# EAGLE design Board1 (EAGLE 9.3.2)
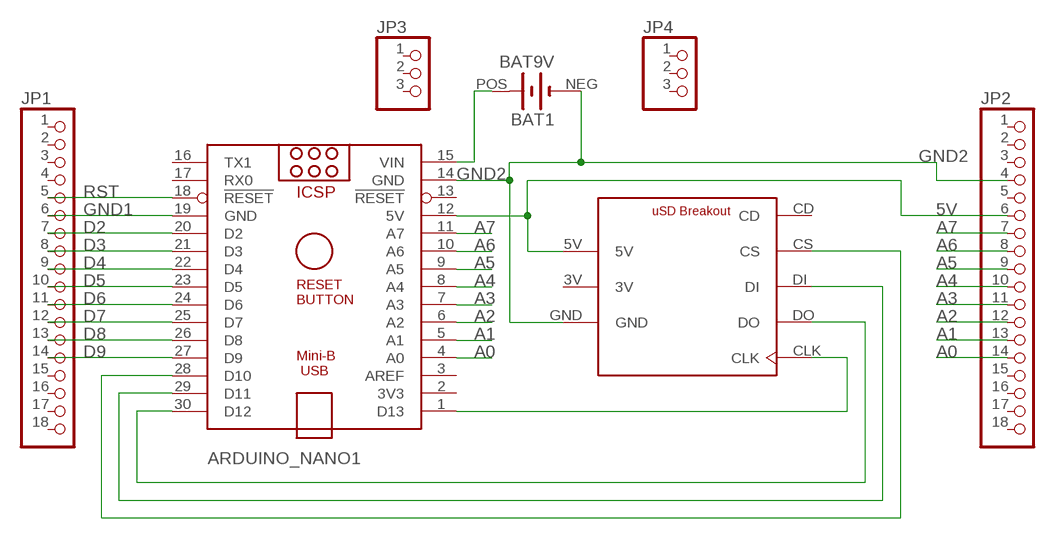
[diagram p0: schematic, sheet 1]

## Parts
ARDUINO_NANO1  ARDUINO_NANO  [ARDUINO_NANO]
BAT1  BAT9V  [BAT9V]
JP1  PINHD-1X18  [1X18]
JP2  PINHD-1X18  [1X18]
JP3  PINHD-1X3  [1X03]
JP4  PINHD-1X3  [1X03]
USD1  ADA254  [ADA254]

## Nets
5V [power]: ARDUINO_NANO1.12(5V) JP2.6 USD1.5V
A0: ARDUINO_NANO1.4(A0) JP2.14
A1: ARDUINO_NANO1.5(A1) JP2.13
A2: ARDUINO_NANO1.6(A2) JP2.12
A3: ARDUINO_NANO1.7(A3) JP2.11
A4: ARDUINO_NANO1.8(A4) JP2.10
A5: ARDUINO_NANO1.9(A5) JP2.9
A6: ARDUINO_NANO1.10(A6) JP2.8
A7: ARDUINO_NANO1.11(A7) JP2.7
D2: ARDUINO_NANO1.20(D2) JP1.7
D3: ARDUINO_NANO1.21(D3) JP1.8
D4: ARDUINO_NANO1.22(D4) JP1.9
D5: ARDUINO_NANO1.23(D5) JP1.10
D6: ARDUINO_NANO1.24(D6) JP1.11
D7: ARDUINO_NANO1.25(D7) JP1.12
D8: ARDUINO_NANO1.26(D8) JP1.13
D9: ARDUINO_NANO1.27(D9) JP1.14
GND1: ARDUINO_NANO1.19(GND) JP1.6
GND2 [power]: ARDUINO_NANO1.14(GND) BAT1.NEG(-) JP2.4 USD1.GND
N$3: ARDUINO_NANO1.1(D13) USD1.CLK
N$4: ARDUINO_NANO1.30(D12) USD1.DO
N$5: ARDUINO_NANO1.29(D11) USD1.DI
N$6: ARDUINO_NANO1.28(D10) USD1.CS
N$16 [power]: ARDUINO_NANO1.15(VIN) BAT1.POS(+)
RST: ARDUINO_NANO1.18(!RESET) JP1.5
Unconnected: ARDUINO_NANO1.2(3V3) ARDUINO_NANO1.3(AREF) ARDUINO_NANO1.13(!RESET) ARDUINO_NANO1.16(TX1) ARDUINO_NANO1.17(RX0) JP1.1 JP1.2 JP1.3 JP1.4 JP1.15 JP1.16 JP1.17 JP1.18 JP2.1 JP2.2 JP2.3 JP2.5 JP2.15 JP2.16 JP2.17 JP2.18 JP3.1 JP3.2 JP3.3 JP4.1 JP4.2 JP4.3 USD1.3V USD1.CD

## Library data of the parts
ARDUINO_NANO1 = ArduinoNanoV30:ARDUINO_NANO: Arduino Nano V3.0 Overview: The Arduino Nano is a small, complete, and breadboard-friendly board based on the ATmega328 (Arduino Nano 3.x) or ATmega168 (Arduino Nano 2.x). It has more or less the same functionality of the Arduino Duemilanove, but in a different package. It lacks only a DC power jack, and works with a Mini-B USB cable instead of a standard one. The Nano was designed and is being produced by Gravitech. Specifications: Microcontroller Atmel ATmega168 or ATmega328 Operating Voltage (logic level) 5 V Input Voltage (recommended) 7-12 V Input Voltage (limits) 6-20 V Digital I/O Pins 14 (of which 6 provide PWM output) Analog Input Pins 8 DC Current per I/O Pin 40 mA Flash Memory 16 KB (ATmega168) or 32 KB (ATmega328) of which 2 KB used by bootloader SRAM 1 KB (ATmega168) or 2 KB (ATmega328) EEPROM 512 bytes (ATmega168) or 1 KB (ATmega328) Clock Speed 16 MHz Dimensions 0.73" x 1.70" Length 45 mm Width 18 mm Weigth 5 g Power: The Arduino Nano can be powered via the Mini-B USB connection, 6-20V unregulated external power supply (pin 30), or 5V regulated external power supply (pin 27). The power source is automatically selected to the highest voltage source. Memory: The ATmega168 has 16 KB of flash memory for storing code (of which 2 KB is used for the bootloader); the ATmega328 has 32 KB, (also with 2 KB used for the bootloader). The ATmega168 has 1 KB of SRAM and 512 bytes of EEPROM (which can be read and written with the EEPROM library); the ATmega328 has 2 KB of SRAM and 1 KB of EEPROM. Input and Output: Each of the 14 digital pins on the Nano can be used as an input or output, using pinMode(), digitalWrite(), and digitalRead() functions. They operate at 5 volts. Each pin can provide or receive a maximum of 40 mA and has an internal pull-up resistor (disconnected by default) of 20-50 kOhms. In addition, some pins have specialized functions. Visit Arduino - ArduinoBoardNano <https://www.arduino.cc/en/Main/ArduinoBoardNano>
BAT1 = cwParts:BAT9V
JP1 JP2 = pinhead:PINHD-1X18: PIN HEADER
JP3 JP4 = pinhead:PINHD-1X3: PIN HEADER
USD1 = cwParts:ADA254: Adafruit microSD breakout

## Net classes
1 power: width 0.508 mm

## Board
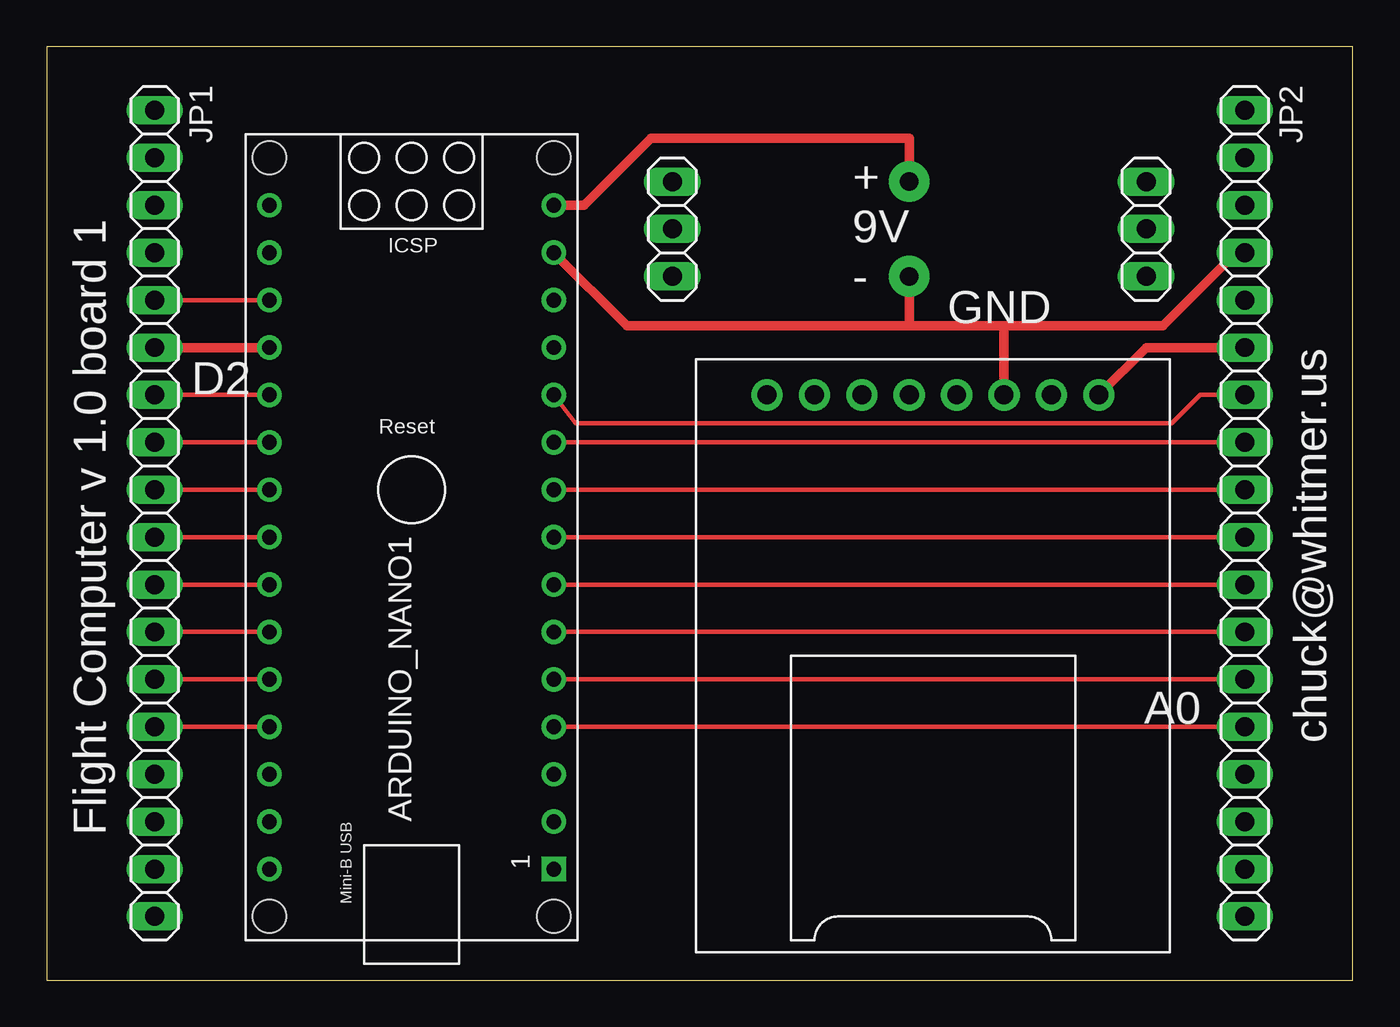
[diagram p1: board, top side]
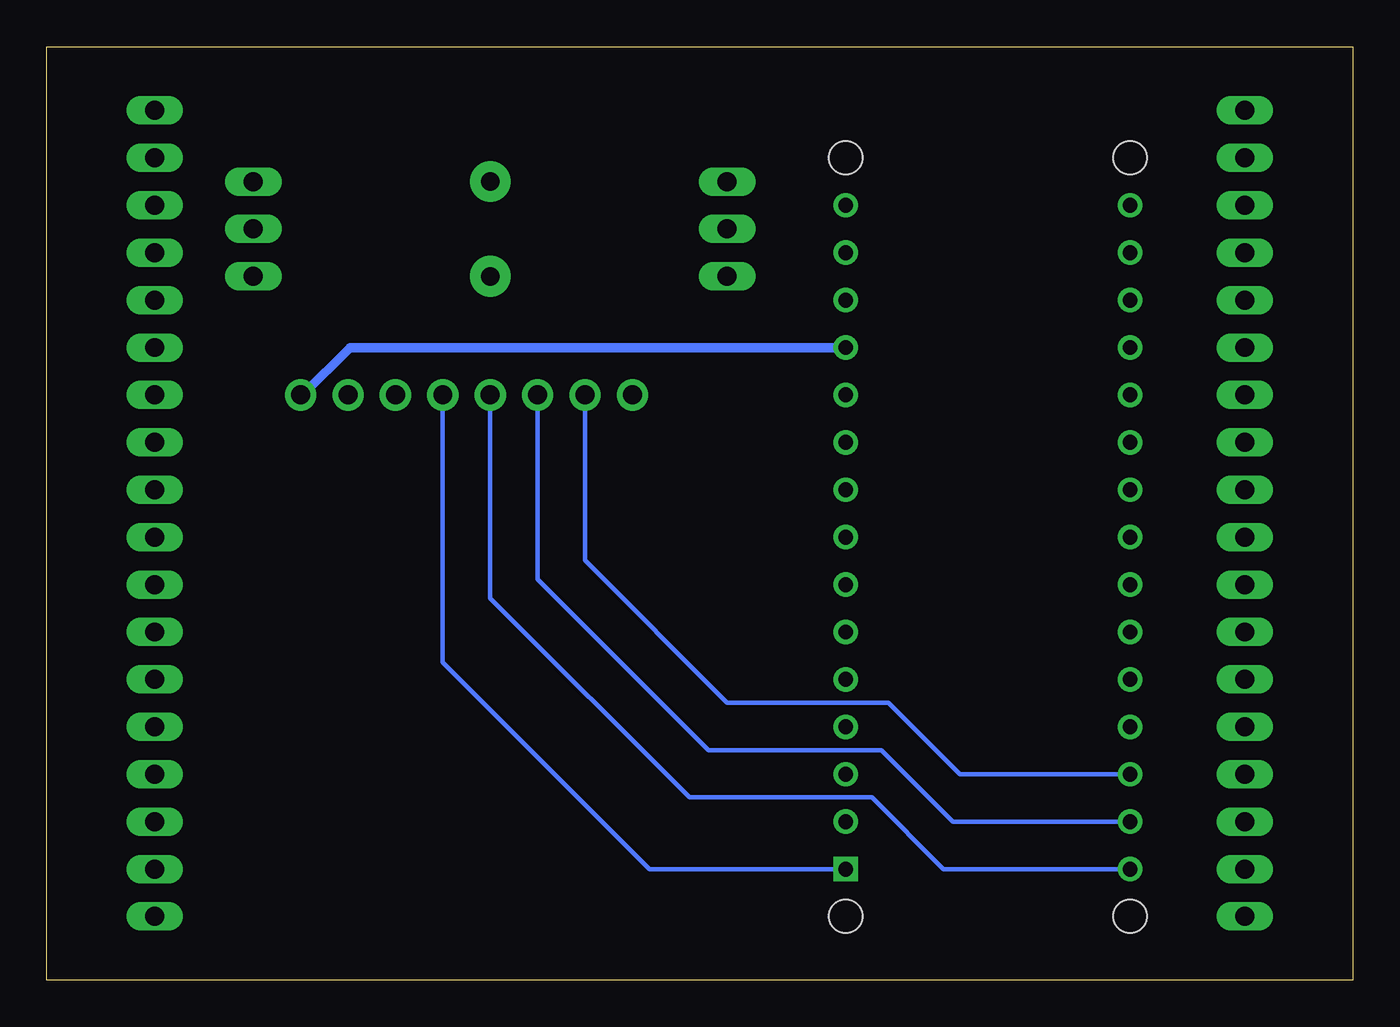
[diagram p2: board, bottom side, seen from below]

Size 70 x 50 mm. Coordinates in mm from the lower left corner, seen from the top.
Outline: 0,0 70,0 70,50 0,50 0,0
Copper layers (1*16): Top 0.035mm / dielectric 1.5mm / Bottom 0.035mm
Design rules "default": minimum track width 6mil, minimum drill 0.35mm, track to track 6mil, track to pad 6mil, pad to pad 6mil, via to via 6mil, smd to smd 6mil, copper to edge 40mil, drill to drill 6mil, minimum pad ring 10mil, minimum via ring 8mil, stop-mask expansion 4mil, vias tented up to drill 0mil, thermal gap 10mil

### Footprints (pad centres in the part's own frame; a part is rotated, then mirrored left to right if it is on the bottom)
ARDUINO_NANO = drill 0.8 square: 1 -20.32,-7.62 | drill 0.8: 2 -17.78,-7.62; 3 -15.24,-7.62; 4 -12.7,-7.62; 5 -10.16,-7.62; 6 -7.62,-7.62; 7 -5.08,-7.62; 8 -2.54,-7.62; 9 0,-7.62; 10 2.54,-7.62; 11 5.08,-7.62; 12 7.62,-7.62; 13 10.16,-7.62; 14 12.7,-7.62; 15 15.24,-7.62; 16 15.24,7.62; 17 12.7,7.62; 18 10.16,7.62; 19 7.62,7.62; 20 5.08,7.62; 21 2.54,7.62; 22 0,7.62; 23 -2.54,7.62; 24 -5.08,7.62; 25 -7.62,7.62; 26 -10.16,7.62; 27 -12.7,7.62; 28 -15.24,7.62; 29 -17.78,7.62; 30 -20.32,7.62 | hole 1.778: -22.86,-7.62; -22.86,7.62; 17.78,7.62; 17.78,-7.62
BAT9V = drill 1 pad 2.184: NEG -2.54,0; POS 2.54,0
1X18 = drill 1.016 long: 1 -21.59,0; 2 -19.05,0; 3 -16.51,0; 4 -13.97,0; 5 -11.43,0; 6 -8.89,0; 7 -6.35,0; 8 -3.81,0; 9 -1.27,0; 10 1.27,0; 11 3.81,0; 12 6.35,0; 13 8.89,0; 14 11.43,0; 15 13.97,0; 16 16.51,0; 17 19.05,0; 18 21.59,0
1X03 = drill 1.016 long: 1 -2.54,0; 2 0,0; 3 2.54,0
ADA254 = drill 1.016 pad 1.676: 3V 13.97,-6.35; 5V 13.97,-8.89; CD 13.97,8.89; CLK 13.97,-1.27; CS 13.97,6.35; DI 13.97,3.81; DO 13.97,1.27; GND 13.97,-3.81

### Placement (x,y rotation side)
ARDUINO_NANO1  19.56,26.26 90 top
BAT1  46.23,40.23 90 top
JP1  5.79,24.99 270 top
JP2  64.21,24.99 270 top
JP3  33.53,40.23 90 top
JP4  58.93,40.23 90 top
USD1  47.5,17.37 90 top

### Tracks (layer width: path | path; a pad name or v marks a point on that pad's centre or on a via)
5V
  Top 0.508: USD1.5V 58.93,33.88 JP2.6
  Bottom 0.152: 56.29,31.34 USD1.5V
  Bottom 0.508: ARDUINO_NANO1.12 53.75,33.88 56.29,31.34
A0
  Top 0.254: JP2.14 ARDUINO_NANO1.4
A1
  Top 0.254: ARDUINO_NANO1.5 JP2.13
A2
  Top 0.254: ARDUINO_NANO1.6 JP2.12
A3
  Top 0.254: JP2.11 ARDUINO_NANO1.7
A4
  Top 0.254: ARDUINO_NANO1.8 JP2.10
A5
  Top 0.254: ARDUINO_NANO1.9 JP2.9
A6
  Top 0.254: ARDUINO_NANO1.10 JP2.8
A7
  Top 0.254: ARDUINO_NANO1.11 28.35,29.82 60.3,29.82 61.82,31.34 JP2.7
D2
  Top 0.254: JP1.7 ARDUINO_NANO1.20
D3
  Top 0.254: JP1.8 ARDUINO_NANO1.21
D4
  Top 0.254: JP1.9 ARDUINO_NANO1.22
D5
  Top 0.254: JP1.10 ARDUINO_NANO1.23
D6
  Top 0.254: JP1.11 ARDUINO_NANO1.24
D7
  Top 0.254: JP1.12 ARDUINO_NANO1.25
D8
  Top 0.254: JP1.13 ARDUINO_NANO1.26
D9
  Top 0.254: JP1.14 ARDUINO_NANO1.27
GND1
  Top 0.508: JP1.6 ARDUINO_NANO1.19
GND2
  Top 0.152: 63.73,38.96 JP2.4
  Top 0.508: ARDUINO_NANO1.14 31.09,35.05 46.23,35.05 | 46.23,35.05 51.31,35.05 | 51.31,35.05 59.82,35.05 63.73,38.96 | BAT1.NEG 46.23,35.05 | USD1.GND 51.31,35.05
N$3
  Bottom 0.254: ARDUINO_NANO1.1 37.69,5.94 48.77,17.02 USD1.CLK
N$4
  Bottom 0.254: ARDUINO_NANO1.30 21.95,5.94 25.78,9.78 35.56,9.78 46.23,20.45 USD1.DO
N$5
  Bottom 0.254: ARDUINO_NANO1.29 21.44,8.48 25.27,12.32 34.54,12.32 43.69,21.46 USD1.DI
N$6
  Bottom 0.254: ARDUINO_NANO1.28 21.06,11.02 24.89,14.86 33.53,14.86 41.15,22.48 USD1.CS
N$16
  Top 0.508: ARDUINO_NANO1.15 28.8,41.5 32.38,45.09 46.23,45.09 BAT1.POS
RST
  Top 0.254: JP1.5 ARDUINO_NANO1.18

### Text on the board
tPlace: + / 9V / - | GND | D2 | A0 | chuck@whitmer.us | Flight Computer v 1.0 board 1